# EAGLE design m1k-buffermod-d1 (EAGLE 7.7.0)
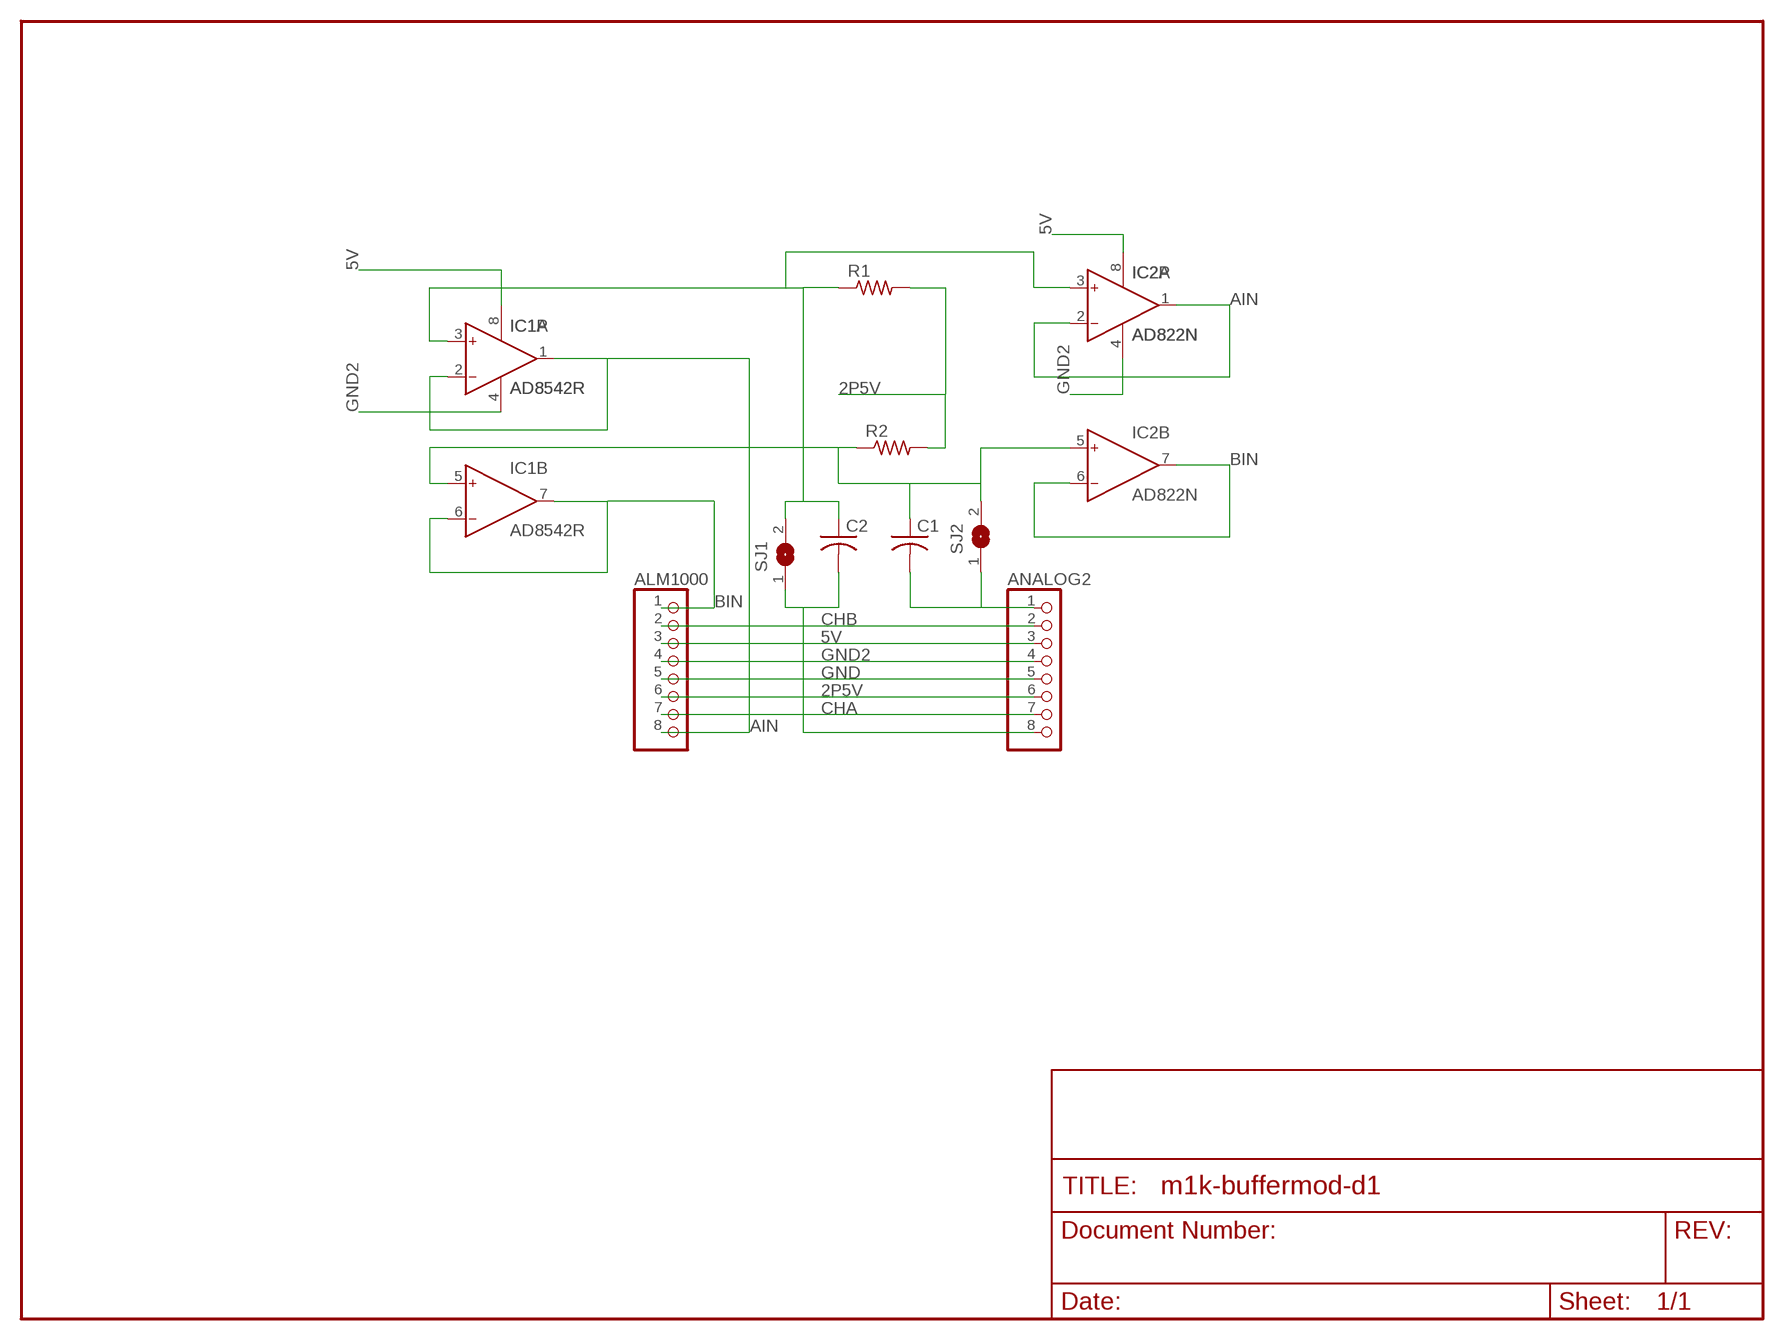
[diagram p0: schematic, sheet 1]

## Parts
ALM1000  PINHD-1X8  [1X08]
ANALOG2  PINHD-1X8  [1X08]
C1  C-US050-024X044  [C050-024X044]
C2  C-US050-024X044  [C050-024X044]
IC1  AD8542R  [SO8]
IC2  AD822N  [DIL08]
R1  R-US_0204/7  [0204/7]
R2  R-US_0204/7  [0204/7]
SJ1  SJ  [SJ]
SJ2  SJ  [SJ]

## Nets
2P5V: ALM1000.6 ANALOG2.6 R1.2 R2.2
5V: ALM1000.3 ANALOG2.3 IC1.8(P:V+) IC2.8(P:V+)
AIN: ALM1000.8 IC1.1(A:OUT) IC1.2(A:IN-) IC2.1(A:OUT) IC2.2(A:IN-)
BIN: ALM1000.1 IC1.6(B:IN-) IC1.7(B:OUT) IC2.6(B:IN-) IC2.7(B:OUT)
CHA: ALM1000.7 ANALOG2.7
CHB: ALM1000.2 ANALOG2.2
GND: ALM1000.5 ANALOG2.5
GND2: ALM1000.4 ANALOG2.4 IC1.4(P:V-) IC2.4(P:V-)
N$1: ANALOG2.1 C1.2 SJ2.1
N$3: ANALOG2.8 C2.2 SJ1.1
N$5: C2.1 IC1.3(A:IN+) IC2.3(A:IN+) R1.1 SJ1.2
N$6: C1.1 IC1.5(B:IN+) IC2.5(B:IN+) R2.1 SJ2.2

## Library data of the parts
ALM1000 ANALOG2 = pinhead:PINHD-1X8: PIN HEADER
C1 C2 = rcl:C-US: CAPACITOR, American symbol
IC1 = analog-devices:AD8542: General-Purpose CMOS Rail-to-Rail Amplifiers Source: http://www.analog.com/static/imported-files/data_sheets/AD8541_8542_8544.pdf; MF: ALTERA CORPORATION; MPN: AD8542ARZ-REEL; OC_FARNELL: 1424150; OC_NEWARK: 59K6827
IC2 = analog-devices:AD822: Single-Supply, Rail-to-Rail Low Power FET-Input Op Amp Source: http://www.analog.com/static/imported-files/data_sheets/AD822.pdf; OC_FARNELL: 1438581; OC_NEWARK: unknown
R1 R2 = resistor:R-US_: RESISTOR, American symbol
SJ1 SJ2 = jumper:SJ: SMD solder JUMPER

## Board
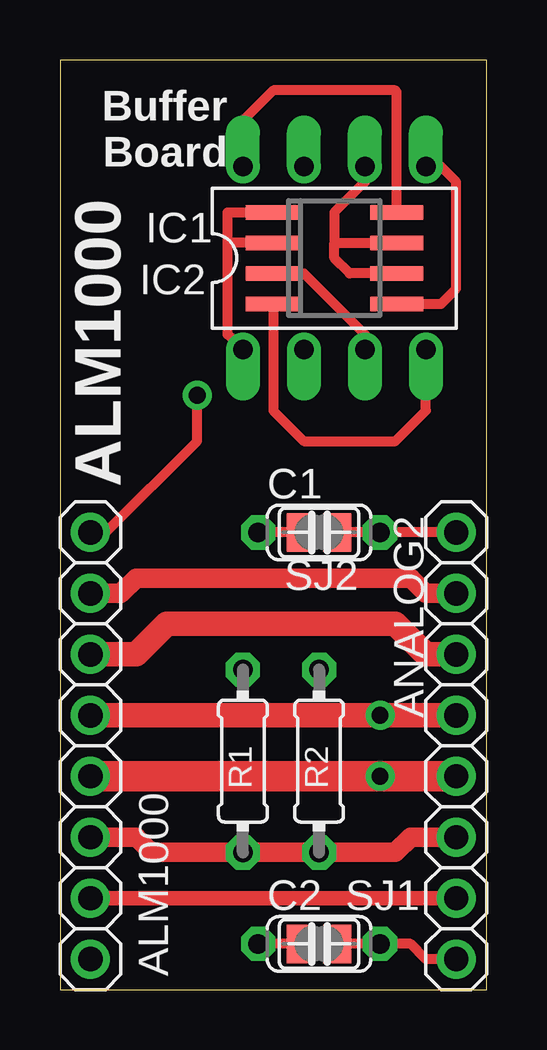
[diagram p1: board, top side]
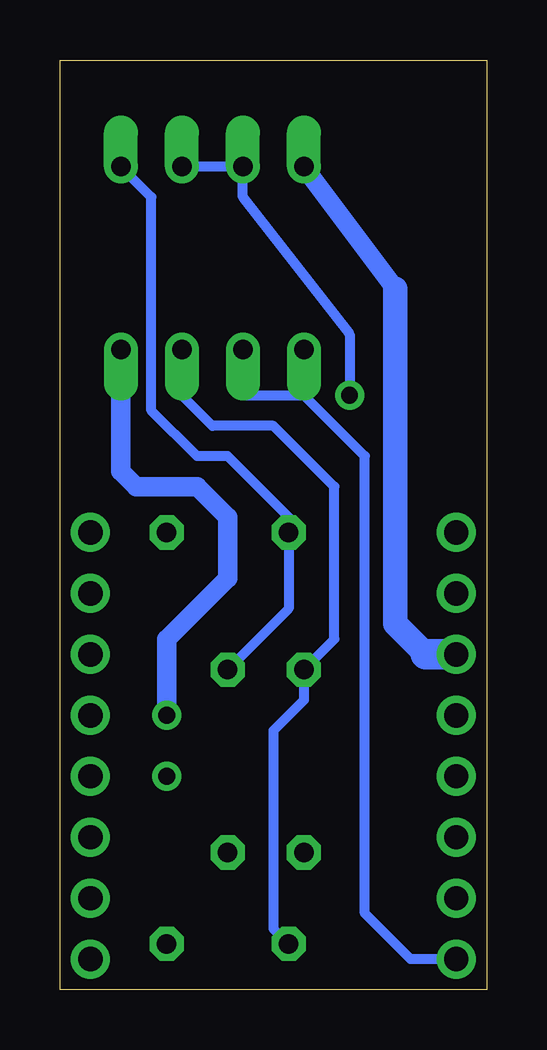
[diagram p2: board, bottom side, seen from below]

Size 17.78 x 38.73 mm. Coordinates in mm from the lower left corner, seen from the top.
Outline: 17.78,0 17.78,38.73 0,38.73 0,0 17.78,0
Copper layers (1*16): Top 0.035mm / dielectric 1.5mm / Bottom 0.035mm
Design rules "default": minimum track width 8mil, minimum drill 20mil, track to track 8mil, track to pad 8mil, pad to pad 8mil, via to via 8mil, smd to smd 8mil, copper to edge 8mil, drill to drill 8mil, minimum pad ring 12mil, minimum via ring 10mil, stop-mask expansion 4mil, vias tented up to drill 20mil, thermal gap 10mil

### Footprints (pad centres in the part's own frame; a part is rotated, then mirrored left to right if it is on the bottom)
1X08 = drill 1.016: 1 -8.89,0; 2 -6.35,0; 3 -3.81,0; 4 -1.27,0; 5 1.27,0; 6 3.81,0; 7 6.35,0; 8 8.89,0
C050-024X044 = drill 0.813 octagon: 1 -2.54,0; 2 2.54,0
SO8 = smd 0.6 x 2.2: 1 -1.905,-2.6; 2 -0.635,-2.6; 3 0.635,-2.6; 4 1.905,-2.6; 5 1.905,2.6; 6 0.635,2.6; 7 -0.635,2.6; 8 -1.905,2.6
DIL08 = drill 0.813 offset: 1 -3.81,-3.81; 2 -1.27,-3.81; 3 1.27,-3.81; 4 3.81,-3.81; 5 3.81,3.81; 6 1.27,3.81; 7 -1.27,3.81; 8 -3.81,3.81
0204/7 = drill 0.813 octagon: 1 -3.81,0; 2 3.81,0
SJ = smd 1.168 x 1.6: 1 -0.762,0; 2 0.762,0

### Placement (x,y rotation side)
ALM1000  1.27,10.16 270 top
ANALOG2  16.51,10.16 270 top
C1  10.79,19.05 0 top
C2  10.79,1.91 0 top
IC1  11.43,30.48 270 top
IC2  11.43,30.48 0 top
R1  7.62,9.53 270 top
R2  10.79,9.53 270 top
SJ1  10.79,1.91 180 top
SJ2  10.79,19.05 180 top

### Tracks (layer width: path | path; a pad name or v marks a point on that pad's centre or on a via)
2P5V
  Top 0.813: ALM1000.6 3.17,6.35 3.81,5.71 R1.2 R2.2 13.97,5.71 14.61,6.35 ANALOG2.6
5V
  Top 0.406: IC1.8 14.03,37.41 13.97,37.47 8.89,37.47 7.62,36.2 IC2.8
  Top 1.016: ALM1000.3 3.17,13.97 4.45,15.24 13.97,15.24 15.24,13.97 ANALOG2.3
  Bottom 0.813: 3.81,29.21 IC2.8
  Bottom 1.016: 2.54,13.97 3.81,15.24 3.81,29.21
  Bottom 1.27: 2.54,13.97 ALM1000.3
AIN
  Top 0.406: 7.62,24.77 IC2.1 6.99,27.3 6.99,31.11 | 6.99,31.11 6.99,32.38 IC1.1 | IC1.2 6.99,31.11
  Bottom 0.406: IC2.2 10.16,24.77 7.62,24.77 | ALM1000.8 3.17,1.27 5.08,3.17 5.08,22.23 7.62,24.77 | 7.62,24.77 IC2.1
BIN  (via drill 0.7)
  Top 0.406: ALM1000.1 1.91,19.05 5.71,22.86 v5.71,24.77 | IC2.6 12.7,33.66 11.43,32.38 11.43,31.11 | 11.43,31.11 IC1.7 | IC1.6 12.06,29.84 11.43,30.48 11.43,31.11
  Bottom 0.406: v5.71,24.77 5.71,27.3 10.16,33.02 IC2.7 IC2.6
CHA
  Top 0.61: ALM1000.7 ANALOG2.7
CHB
  Top 0.813: ALM1000.2 2.54,16.51 3.17,17.14 14.61,17.14 15.24,16.51 ANALOG2.2
GND  (via drill 0.7)
  Top 1.27: ALM1000.5 v13.34,8.89 ANALOG2.5
GND2  (via drill 0.7)
  Top 0.406: IC1.4 8.89,28.57 8.89,24.13 10.16,22.86 13.97,22.86 15.24,24.13 IC2.4
  Top 1.016: ALM1000.4 v13.34,11.43 ANALOG2.4
  Bottom 0.813: IC2.4 15.24,21.59 14.61,20.95 12.06,20.95 10.79,19.68 10.79,17.14 13.34,14.61 v13.34,11.43
N$1
  Top 0.406: ANALOG2.1 C1.2 SJ2.1
N$3
  Top 0.406: ANALOG2.8 15.24,1.27 14.61,1.91 C2.2 SJ1.1
N$5
  Top 0.406: SJ1.2 C2.1 | IC1.3 10.16,29.84 12.7,27.3 IC2.3
  Bottom 0.406: IC2.3 12.7,24.77 11.43,23.5 8.89,23.5 6.35,20.95 6.35,14.61 R1.1 7.62,12.06 8.89,10.79 8.89,2.54 C2.1
N$6
  Top 0.406: SJ2.2 C1.1 | IC1.5 15.88,28.57 16.51,29.21 16.51,33.66 15.88,34.29 IC2.5
  Bottom 0.406: R2.1 8.26,15.88 C1.1 8.26,19.68 10.79,22.23 12.06,22.23 13.97,24.13 13.97,33.02 IC2.5

### Text on the board
tPlace: Buffer / Board | ALM1000